# Altium schematic sheet top.SchDoc: WZ1262 - WIZnet Connect the Magic 2014 Design Challenge
size A4; Revision: 1.0
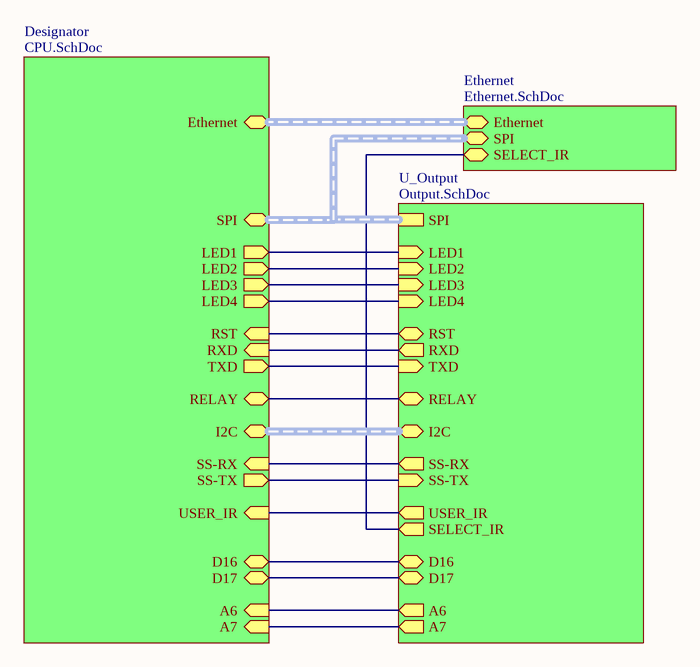
[diagram p0: top.SchDoc]

## Sub-sheets
Designator = CPU.SchDoc: A6 (in), A7 (in), D16, Ethernet (harness Ethernet), I2C (harness I2C), LED1 (out), LED2 (out), LED3 (out), LED4 (out), RELAY, RST (in), RXD (in), SPI (harness SPI), SS-RX (in), SS-TX (out), TXD (out), USER_IR (in), D17
Ethernet = Ethernet.SchDoc: SPI (harness SPI), Ethernet (harness Ethernet), SELECT_IR
U_Output = Output.SchDoc: LED1, LED2, LED3, SPI (harness SPI), RST, RXD, TXD, LED4, RELAY, I2C (harness I2C), SS-RX (out), SS-TX (in), USER_IR (out), D16, D17, A6 (out), A7 (out), SELECT_IR (out)

## Nets
(unnamed): sheet Designator/A6, sheet U_Output/A6
(unnamed): sheet Designator/A7, sheet U_Output/A7
(unnamed): sheet Designator/D16, sheet U_Output/D16
(unnamed): sheet Designator/LED1, sheet U_Output/LED1
(unnamed): sheet Designator/LED2, sheet U_Output/LED2
(unnamed): sheet Designator/LED3, sheet U_Output/LED3
(unnamed): sheet Designator/LED4, sheet U_Output/LED4
(unnamed): sheet Designator/RELAY, sheet U_Output/RELAY
(unnamed): sheet Designator/RST, sheet U_Output/RST
(unnamed): sheet Designator/RXD, sheet U_Output/RXD
(unnamed): sheet Designator/SS-RX, sheet U_Output/SS-RX
(unnamed): sheet Designator/SS-TX, sheet U_Output/SS-TX
(unnamed): sheet Designator/TXD, sheet U_Output/TXD
(unnamed): sheet Designator/USER_IR, sheet U_Output/USER_IR
(unnamed): sheet Designator/D17, sheet U_Output/D17
(unnamed): sheet Ethernet/SELECT_IR, sheet U_Output/SELECT_IR

## Buses and harness runs
harness sheet Designator/Ethernet = sheet Ethernet/Ethernet
harness sheet Designator/I2C = sheet U_Output/I2C
harness sheet Designator/SPI = sheet Ethernet/SPI = sheet U_Output/SPI